# Altium schematic sheet 2.ADC.SchDoc
size A3; SheetNumber: 3; SheetTotal: 4
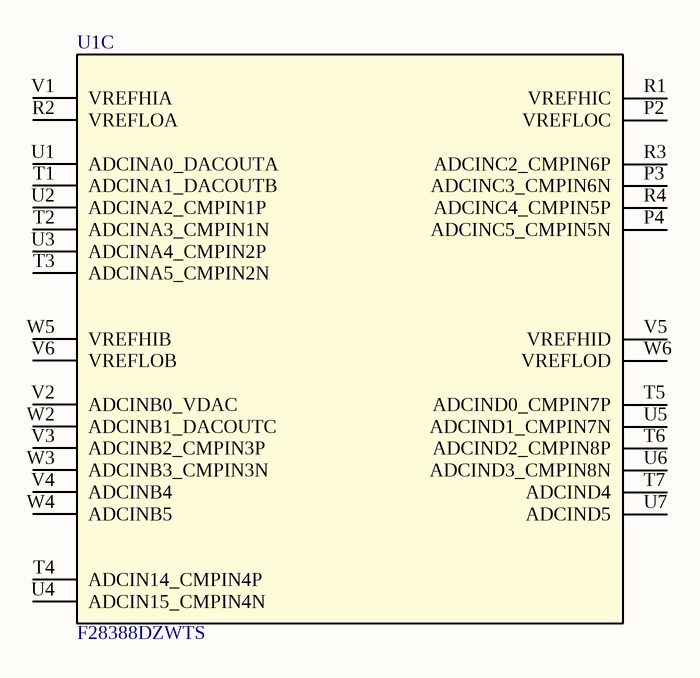
[diagram p0: 2.ADC.SchDoc]

## Parts
U1  F28388DZWTS  [ZWT0337A-IPC_A]  (part C of 8)

## Nets

Not connected (* = marked no-connect by the designer): U1 P2(VREFLOC) P3(ADCINC3_CMPIN6N) P4(ADCINC5_CMPIN5N) R1(VREFHIC) R2(VREFLOA) R3(ADCINC2_CMPIN6P) R4(ADCINC4_CMPIN5P) T1(ADCINA1_DACOUTB) T2(ADCINA3_CMPIN1N) T3(ADCINA5_CMPIN2N) T4(ADCIN14_CMPIN4P) T5(ADCIND0_CMPIN7P) T6(ADCIND2_CMPIN8P) T7(ADCIND4) U1(ADCINA0_DACOUTA) U2(ADCINA2_CMPIN1P) U3(ADCINA4_CMPIN2P) U4(ADCIN15_CMPIN4N) U5(ADCIND1_CMPIN7N) U6(ADCIND3_CMPIN8N) U7(ADCIND5) V1(VREFHIA) V2(ADCINB0_VDAC) V3(ADCINB2_CMPIN3P) V4(ADCINB4) V5(VREFHID) V6(VREFLOB) W2(ADCINB1_DACOUTC) W3(ADCINB3_CMPIN3N) W4(ADCINB5) W5(VREFHIB) W6(VREFLOD)

## Library data of the parts
U1 = F28388DZWTS: C2000â„¢ 32-bit MCU w/ connectivity manager, 2x C28x+CLA CPU, 1.5-MB flash, FPU64, CLB, ENET, EtherCAT 337-NFBGA -40 to 125; Manufacturer_Name: Texas Instruments; TYPE: TYPE; RefDes: RefDes; Copyright: Copyright (C) 2025 Ultra Librarian. All rights reserved.; Manufacturer_Part_Number: F28388DZWTS